# Altium schematic sheet LCD_Schem.SchDoc
size A; SheetNumber: 6; SheetTotal: 6
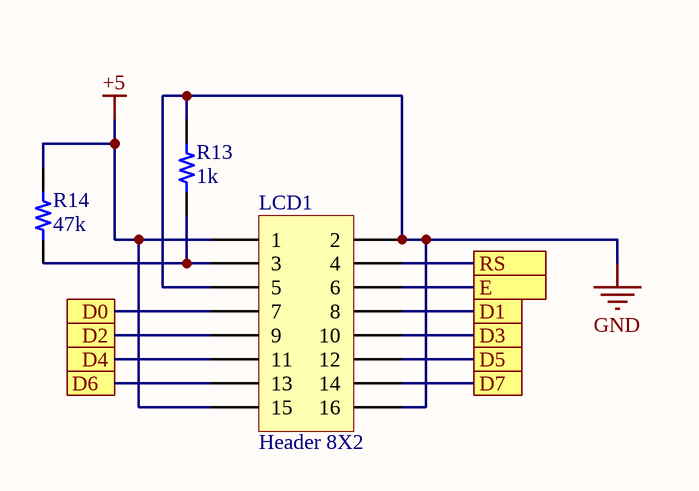
[diagram p0: LCD_Schem.SchDoc]

## Parts
LCD1  Header 8X2  [HDR2X8]
R13  1k  [RES 1206_3216]
R14  47k  [RES 1206_3216]

## Ports
D0, D1, D2, D3, D4, D5, D6, D7, E, RS

## Nets
+5: LCD1.1 LCD1.15 R14.2
GND: LCD1.2 LCD1.5 LCD1.16 R13.2
D0: LCD1.7 ; port D0
D1: LCD1.8 ; port D1
D2: LCD1.9 ; port D2
D3: LCD1.10 ; port D3
D4: LCD1.11 ; port D4
D5: LCD1.12 ; port D5
D6: LCD1.13 ; port D6
D7: LCD1.14 ; port D7
E: LCD1.6 ; port E
RS: LCD1.4 ; port RS
NetLCD1_3: LCD1.3 R13.1 R14.1

## Library data of the parts
LCD1 = Header 8X2: Header, 8-Pin, Dual row; LatestRevisionDate: 17-Jul-2002; LatestRevisionNote: Re-released for DXP Platform.; Publisher: Altium Limited
R13 R14 = ESR18EZPF1002: RES SMD 10K OHM 1% 1/2W 1206; Manufacturer: Rohm Semiconductor; Power (Watts): 0.5W, 1/2W; Resistance: 10 kOhms; Temperature Coefficient: ±100ppm/°C; Value: 10 kOhms; Part Number: ESR18EZPF1002; ComponentLink1Description: Datasheet; ComponentLink1URL: https://www.rohm.com/datasheet/ESR01MZPF/esr-e; ComponentLink2Description: DigiKey Link; ComponentLink2URL: https://www.digikey.com/en/products/detail/rohm-semiconductor/ESR18EZPF1002/1983592; Composition: Thick Film; Device Package: 1206 (3216 Metric); Features: Automotive AEC-Q200, Pulse Withstanding; Height - Seated (Max): 0.026" (0.65mm); LastUpdated: 9/19/2022 1:29:57 PM; Lifecycle Status: Active; Minimum Order: 1; Number of Terminations: 2; Operating Temperature: -55°C ~ 155°C; Package / Case: 1206 (3216 Metric); Packaging: TapeAndReel; PartId: 26965; Part Status: Active; Price: 0.02; Ratings: AEC-Q200; Series: ESR; Size / Dimension: 0.126" L x 0.063" W (3.20mm x 1.60mm); Supplier 1: DigiKey; Supplier Part Number 1: RHM10.0KAFCT-ND; Supplier Device Package: 1206; Tolerance: ±1%